# EAGLE schematic LEDnecklace (EAGLE 7.5.0)
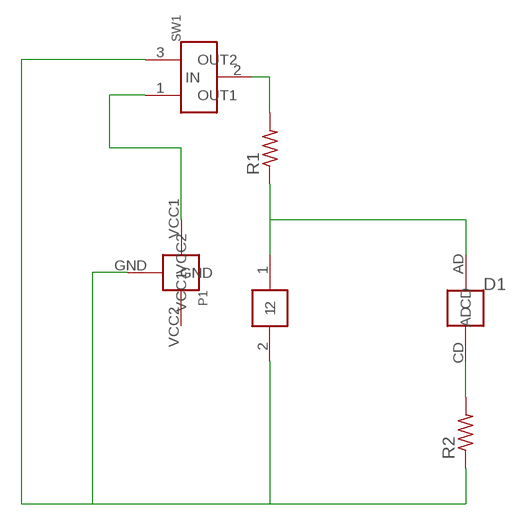
[diagram p0: schematic, sheet 1]

## Parts
D1  XLAMP_XBD  [XLAMP_XBD]
P1  CR1220  [CR1220/1225]
PC1  PDV-P8101  [PHOTOCELL_CERAMIC]
R1  R-US_R0603  [R0603]
R2  R-US_R0603  [R0603]
SW1  PCM12SMTR  [PCM12SMTR]

## Nets
N$1: R1.2 SW1.2(IN)
N$2: P1.GND PC1.2 R2.1 SW1.3(OUT2)
N$3: P1.VCC1 SW1.1(OUT1)
N$4: D1.AD PC1.1 R1.1
N$5: D1.CD R2.2
Unconnected: P1.VCC2

## Library data of the parts
D1 = freddyLibr:XLAMP_XBD
P1 = freddyLibr:CR1220
PC1 = freddyLibr:PDV-P8101: Photocell in ceramic package
R1 R2 = resistor:R-US_: RESISTOR, American symbol
SW1 = freddyLibr:PCM12SMTR: Three pin switch. Horizontal gull wing surface mount.